# Altium schematic sheet Sensor.SchDoc
size A4; Organization: Altium Limited; Address1: L3, 12a Rodborough Rd; Address2: Frenchs Forest; Address3: NSW; Address4: Australia 2086
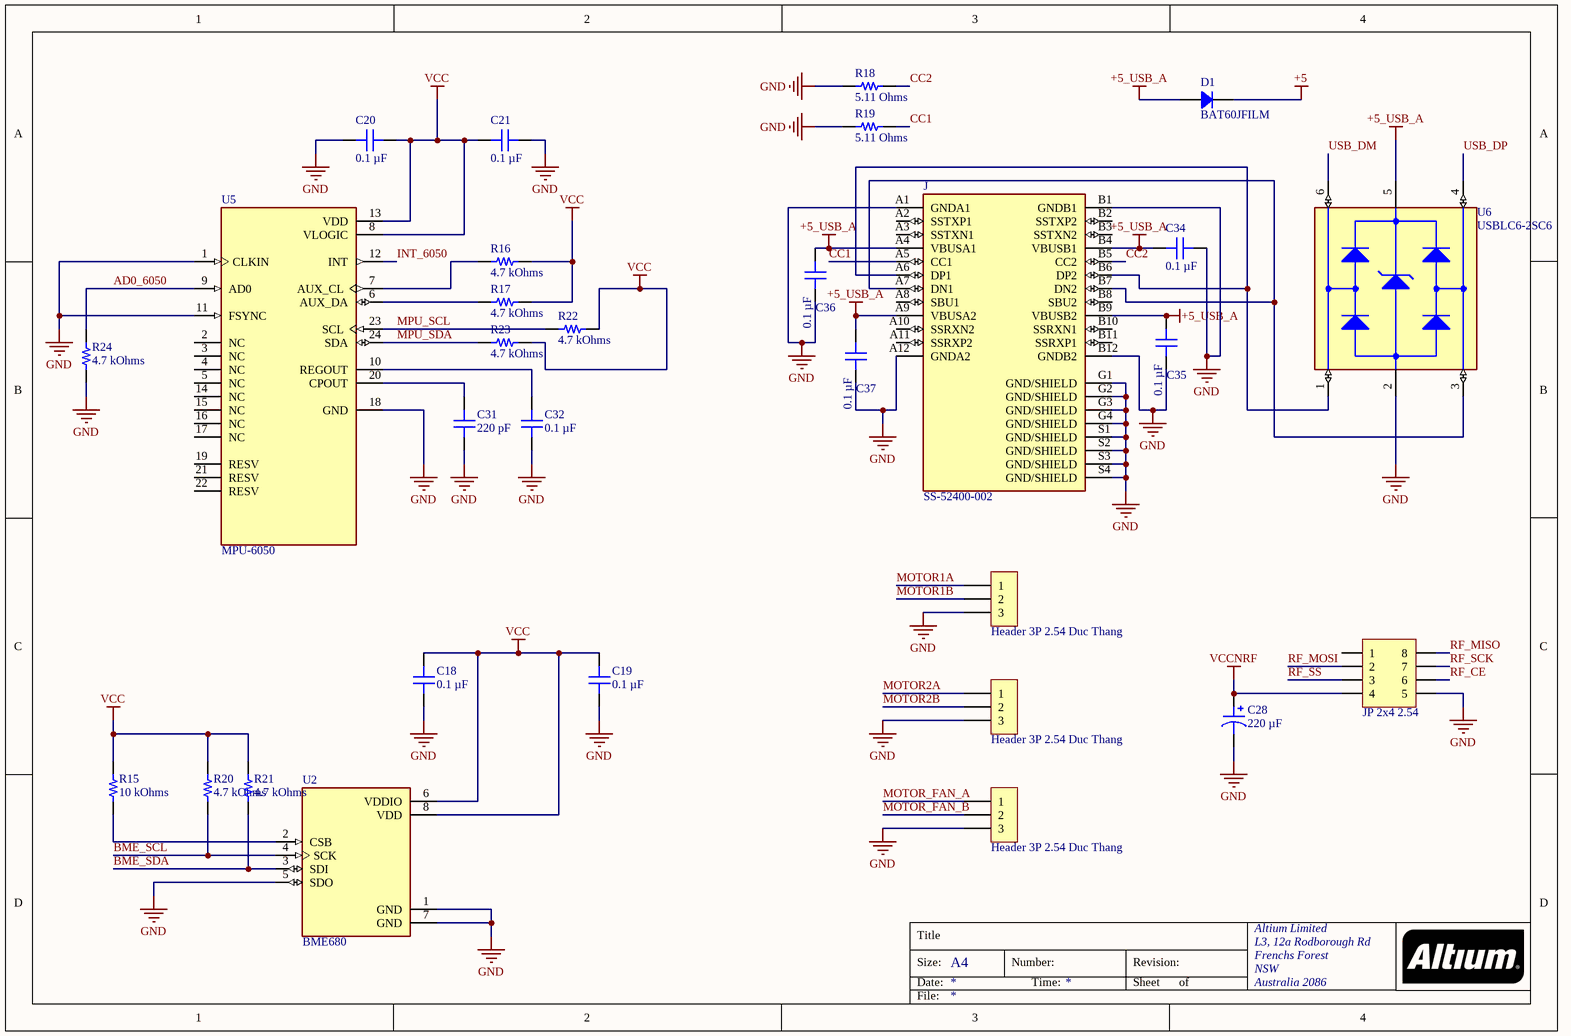
[diagram p0: Sensor.SchDoc]

## Parts
C18  0.1 µF  [CAP 0603_1608]
C19  0.1 µF  [CAP 0603_1608]
C20  0.1 µF  [CAP 0603_1608]
C21  0.1 µF  [CAP 0603_1608]
C28  220 µF  [CAP ALSMD 6.6MM H6.1MM]
C31  220 pF  [CAP 0603_1608]
C32  0.1 µF  [CAP 0603_1608]
C34  0.1 µF  [CAP 0402_1005]
C35  0.1 µF  [CAP 0402_1005]
C36  0.1 µF  [CAP 0402_1005]
C37  0.1 µF  [CAP 0402_1005]
D1  BAT60JFILM  [SOD323]
H3  Header 3P 2.54 Duc Thang  [XH2.54M-3]
H4  Header 3P 2.54 Duc Thang  [XH2.54M-3]
H7  Header 3P 2.54 Duc Thang  [XH2.54M-3]
J  SS-52400-002  [BELFUSE_SS-52400-002]
JP2  JP 2x4 2.54  [JP 2x4 CT]
R15  10 kOhms  [RES 0603_1608]
R16  4.7 kOhms  [RES 0603_1608]
R17  4.7 kOhms  [RES 0603_1608]
R18  5.11 Ohms  [RES 0603_1608]
R19  5.11 Ohms  [RES 0603_1608]
R20  4.7 kOhms  [RES 0603_1608]
R21  4.7 kOhms  [RES 0603_1608]
R22  4.7 kOhms  [RES 0603_1608]
R23  4.7 kOhms  [RES 0603_1608]
R24  4.7 kOhms  [RES 0603_1608]
U2  BME680  [PSON80P300X300X100-8N]
U5  MPU-6050  [QFN50P400X400X95-24N]
U6  USBLC6-2SC6  [SOT95P280X145-6N]

## Nets
+5: D1.2
+5_USB_A: C34.1 C35.1 C36.1 C37.1 D1.1 J.A4(VBUSA1) J.A9(VBUSA2) J.B4(VBUSB1) J.B9(VBUSB2) U6.5(VBUS)
GND: C18.1 C19.1 C20.1 C21.2 C28.2 C31.1 C32.1 C34.2 C35.2 C36.2 C37.2 H3.3 H4.3 H7.3 J.A1(GNDA1) J.A12(GNDA2) J.B1(GNDB1) J.B12(GNDB2) J.G1(GND/SHIELD) J.G2(GND/SHIELD) J.G3(GND/SHIELD) J.G4(GND/SHIELD) J.S1(GND/SHIELD) J.S2(GND/SHIELD) J.S3(GND/SHIELD) J.S4(GND/SHIELD) JP2.5 R18.1 R19.1 R24.1 U2.1(GND) U2.5(SDO) U2.7(GND) U5.1(CLKIN) U5.11(FSYNC) U5.18(GND) U6.2(GND)
VCC: C18.2 C19.2 C20.2 C21.1 R15.2 R16.2 R17.2 R20.2 R21.2 R22.2 R23.2 U2.6(VDDIO) U2.8(VDD) U5.8(VLOGIC) U5.13(VDD)
VCCNRF: C28.1 JP2.4
AD0_6050: R24.2 U5.9(AD0)
BME_SCL: R20.1 U2.4(SCK)
BME_SDA: R21.1 U2.3(SDI)
CC1: J.A5(CC1) R19.2
CC2: J.B5(CC2) R18.2
INT_6050: U5.12(INT)
MOTOR1A: H7.1
MOTOR1B: H7.2
MOTOR2A: H3.1
MOTOR2B: H3.2
MOTOR_FAN_A: H4.1
MOTOR_FAN_B: H4.2
MPU_SCL: R22.1 U5.23(SCL)
MPU_SDA: R23.1 U5.24(SDA)
RF_CE: JP2.6
RF_MISO: JP2.8
RF_MOSI: JP2.2
RF_SCK: JP2.7
RF_SS: JP2.3
USB_DM: U6.6(I/O1_OUT)
USB_DP: U6.4(I/O2_OUT)
NetC31_2: C31.2 U5.20(CPOUT)
NetC32_2: C32.2 U5.10(REGOUT)
NetJ_A6: J.A6(DP1) J.B6(DP2) U6.1(I/O1_IN)
NetJ_A7: J.A7(DN1) J.B7(DN2) U6.3(I/O2_IN)
NetR15_1: R15.1 U2.2(CSB)
NetR16_1: R16.1 U5.7(AUX_CL)
NetR17_1: R17.1 U5.6(AUX_DA)

Not connected (* = marked no-connect by the designer): J A2(SSTXP1) A3(SSTXN1) A8(SBU1) A10(SSRXN2) A11(SSRXP2) B2(SSTXP2) B3(SSTXN2) B8(SBU2) B10(SSRXN1) B11(SSRXP1); JP2 1; U5 2(NC) 3(NC) 4(NC) 5(NC) 14(NC) 15(NC) 16(NC) 17(NC) 19(RESV) 21(RESV) 22(RESV)

## Notes on the sheet
- Title
- Size:
- Date:
- A4
- Number:
- Time:
- Revision:
- Sheet
- of
- File:

## Library data of the parts
C18-C21 C32 = C0603C104J8RAC7867: CAP CER 0.1UF 10V X7R 0603; manufacturer: KEMET; Tolerance: ±5%; Part Number: C0603C104J8RAC7867; Value: 0.1 µF; Applications: Bypass, Decoupling; Capacitance: 0.1 µF; componentlink1description: Datasheet; componentlink1url: https://connect.kemet.com:7667/gateway/IntelliData-ComponentDocumentation/1.0/download/datasheet/C0603C104J8RACTU; componentlink2description: DigiKey Link; componentlink2url: https://www.digikey.com/en/products/detail/kemet/C0603C104J8RAC7867/2199774; Device Package: 0603 (1608 Metric); lastupdated: 2/9/2024 8:09:18 PM; Lifecycle Status: Active; Minimum Order: 1; Mounting Type: Surface Mount, MLCC; Operating Temperature: -55°C ~ 125°C; Package / Case: 0603 (1608 Metric); packaging: TapeAndReel; partid: 52171; Part Status: Active; price: 0.07; series: SMD Comm X7R; Size / Dimension: 0.063" L x 0.031" W (1.60mm x 0.80mm); Supplier 1: DigiKey; Supplier Part Number 1: 399-C0603C104J8RAC7867CT-ND; Temperature Coefficient: X7R; Thickness (Max): 0.034" (0.87mm); Voltage - Rated: 10V
C28 = UCM1A221MCL1GS: CAP ALUM 220UF 20% 10V SMD; manufacturer: Nichicon; Impedance: 260 mOhms; Lifetime @ Temp.: 2000 Hrs @ 105°C; Polarization: Polar; Ripple Current @ High Frequency: 300 mA @ 100 kHz; Ripple Current @ Low Frequency: 150 mA @ 120 Hz; Surface Mount Land Size: 0.260" L x 0.260" W (6.60mm x 6.60mm); Part Number: UCM1A221MCL1GS; Applications: Automotive; Capacitance: 220 µF; componentlink1description: Datasheet; componentlink1url: http://nichicon-us.com/english/products/pdfs/e-ucm.pdf; componentlink2description: DigiKey Link; componentlink2url: https://www.digikey.com/en/products/detail/nichicon/UCM1A221MCL1GS/4991832; Device Package: Radial, Can - SMD; Height - Seated (Max): 0.240" (6.10mm); lastupdated: 6/3/2024 8:16:09 PM; Lifecycle Status: Active; Minimum Order: 1; Mounting Type: Surface Mount; Operating Temperature: -55°C ~ 105°C; Package / Case: Radial, Can - SMD; packaging: TapeAndReel; partid: 27599; Part Status: Active; price: 0.13; Ratings: AEC-Q200; series: UCM; Size / Dimension: 0.248" Dia (6.30mm); Supplier 1: DigiKey; Supplier Part Number 1: 493-17470-1-ND; Tolerance: ±20%; value: 220 µF; Voltage - Rated: 10 V
C31 = KGM15AR71A221KT: CAP CER 220PF 10V X7R 0603; manufacturer: KYOCERA AVX; Tolerance: ±10%; Part Number: KGM15AR71A221KT; Value: 220 pF; Applications: General Purpose; Capacitance: 220 pF; componentlink1description: Datasheet; componentlink1url: https://datasheets.kyocera-avx.com/X7RDielectric.pdf; componentlink2description: DigiKey Link; componentlink2url: https://www.digikey.com/en/products/detail/kyocera-avx/KGM15AR71A221KT/1600720; Device Package: 0603 (1608 Metric); lastupdated: 2/9/2024 8:09:12 PM; Lifecycle Status: Active; Minimum Order: 1; Mounting Type: Surface Mount, MLCC; Operating Temperature: -55°C ~ 125°C; Package / Case: 0603 (1608 Metric); packaging: TapeAndReel; partid: 53248; Part Status: Active; price: 0.02; series: KGM - X7R; Size / Dimension: 0.063" L x 0.032" W (1.60mm x 0.81mm); Supplier 1: DigiKey; Supplier Part Number 1: 478-KGM15AR71A221KTCT-ND; Temperature Coefficient: X7R; Thickness (Max): 0.035" (0.90mm); Voltage - Rated: 10V
C34-C37 = KGM05AR71A104KH: CAP CER 0.1UF 10V X7R 0402; manufacturer: KYOCERA AVX; Tolerance: ±10%; Part Number: KGM05AR71A104KH; Value: 0.1 µF; Applications: General Purpose; Capacitance: 0.1 µF; componentlink1description: Datasheet; componentlink1url: https://datasheets.kyocera-avx.com/X7RDielectric.pdf; componentlink2description: DigiKey Link; componentlink2url: https://www.digikey.com/en/products/detail/kyocera-avx/KGM05AR71A104KH/3080133; Device Package: 0402 (1005 Metric); lastupdated: 2/9/2024 8:03:47 PM; Lifecycle Status: Active; Minimum Order: 1; Mounting Type: Surface Mount, MLCC; Operating Temperature: -55°C ~ 125°C; Package / Case: 0402 (1005 Metric); packaging: TapeAndReel; partid: 50766; Part Status: Active; price: 0.01; series: KGM - X7R; Size / Dimension: 0.039" L x 0.020" W (1.00mm x 0.50mm); Supplier 1: DigiKey; Supplier Part Number 1: 478-KGM05AR71A104KHCT-ND; Temperature Coefficient: X7R; Thickness (Max): 0.022" (0.55mm); Voltage - Rated: 10V
D1 = BAT60JFILM: DIODE SCHOTTKY 10V 3A SOD323; Manufacturer: STMicroelectronics; Current - Reverse Leakage @ Vr: 6 µA @ 10 V; Speed: Fast Recovery =< 500ns, > 200mA (Io); Voltage - Forward (Vf) (Max) @ If: 580 mV @ 1 A; Part Number: BAT60JFILM; ComponentLink1Description: Datasheet; ComponentLink1URL: http://www.st.com/content/ccc/resource/technical/document/datasheet/3d/d2/27/1d/20/e3/4d/48/CD00001944.pdf/files/CD00001944.pdf/jcr:content/translations/en.CD00001944.pdf; ComponentLink2Description: DigiKey Link; ComponentLink2URL: https://www.digikey.com/en/products/detail/stmicroelectronics/BAT60JFILM/686386; Current - Average Rectified (Io): 3A; Diode Type: Schottky; LastUpdated: 6/3/2024 8:20:13 PM; Lifecycle Status: Active; Minimum Order: 1; Mounting Type: Surface Mount; Operating Temperature - Junction: 150°C (Max); Package / Case: SC-76, SOD-323; Packaging: TapeAndReel; PartId: 3091; Part Status: Active; Price: 0.04; Series: -; Supplier 1: DigiKey; Supplier Part Number 1: 497-3707-1-ND; Supplier Device Package: SOD-323; Voltage - DC Reverse (Vr) (Max): 10 V
H3 H4 H7 = Header 3P 2.54 Duc Thang: Cắm; Ten_Linh_Kien: Header 3P XH2.54-3P Đực Thẳng; Don_Vi: Con; Ma_Hang: MH001292; Chung_Loai: Cắm
J = SS-52400-002: USB Type-C Connector | 1 Port | Right Angle Receptacle | Shielded | 0.039[1.00mm]; MF: Stewart Connector; Package: None; Mouser-Purchase-URL: https://snapeda.com/shop?store=Mouser&id=4629247; Value: *; Price: None; DigiKey-Purchase-URL: https://snapeda.com/shop?store=DigiKey&id=4629247; MP: SS-52400-002; Availability: Warning; SnapEDA_Link: https://www.snapeda.com/parts/SS-52400-002/Stewart%20Connector/view-part/4629247/?ref=snap
JP2 = JP 2x4 2.54 Cai Thang: Cắm; Ten_Linh_Kien: Jump Đôi Cái 2.54MM 2x20P Thẳng; Don_Vi: Con; Ma_Hang: MH008647; Ghi_Chu: *; Kieu_Chan: *; Chung_Loai: Cắm
R15 = CRCW060310K0FKEA: RES SMD 10K OHM 1% 1/10W 0603; Manufacturer: Vishay Dale; Power (Watts): 0.1W, 1/10W; Temperature Coefficient: ±100ppm/°C; Part Number: CRCW060310K0FKEA; Value: 10 kOhms; ComponentLink1Description: Datasheet; ComponentLink1URL: http://www.vishay.com/docs/20035/dcrcwe3.pdf; ComponentLink2Description: DigiKey Link; ComponentLink2URL: https://www.digikey.com/en/products/detail/vishay-dale/CRCW060310K0FKEA/1174782; Composition: Thick Film; Device Package: 0603 (1608 Metric); Features: Automotive AEC-Q200; Height - Seated (Max): 0.020" (0.50mm); LastUpdated: 2/9/2024 8:42:10 PM; Lifecycle Status: Active; Minimum Order: 1; Number of Terminations: 2; Operating Temperature: -55°C ~ 155°C; Package / Case: 0603 (1608 Metric); Packaging: CutTape; PartId: 24636; Part Status: Active; Price: 0.01; Ratings: AEC-Q200; Resistance: 10 kOhms; Series: CRCW; Size / Dimension: 0.061" L x 0.033" W (1.55mm x 0.85mm); Supplier 1: DigiKey; Supplier Part Number 1: 541-10.0KHCT-ND; Supplier Device Package: 0603; Tolerance: ±1%
R16 R17 R22-R24 = CR0603-FX-4701ELF: RES SMD 4.7K OHM 1% 1/10W 0603; Manufacturer: Bourns Inc.; Power (Watts): 0.1W, 1/10W; Temperature Coefficient: ±100ppm/°C; Part Number: CR0603-FX-4701ELF; Value: 4.7 kOhms; ComponentLink1Description: Datasheet; ComponentLink1URL: https://www.bourns.com/docs/Product-Datasheets/CHPREZTR.pdf; ComponentLink2Description: DigiKey Link; ComponentLink2URL: https://www.digikey.com/en/products/detail/bourns-inc/CR0603-FX-4701ELF/3740916; Composition: Thick Film; Device Package: 0603 (1608 Metric); Features: Moisture Resistant; Height - Seated (Max): 0.022" (0.55mm); LastUpdated: 2/9/2024 8:42:33 PM; Lifecycle Status: Active; Minimum Order: 1; Number of Terminations: 2; Operating Temperature: -55°C ~ 155°C; Package / Case: 0603 (1608 Metric); Packaging: CutTape; PartId: 21073; Part Status: Active; Price: 0.01; Resistance: 4.7 kOhms; Series: CR0603; Size / Dimension: 0.063" L x 0.031" W (1.60mm x 0.80mm); Supplier 1: DigiKey; Supplier Part Number 1: CR0603-FX-4701ELFCT-ND; Supplier Device Package: 0603; Tolerance: ±1%
R18 R19 = RMCF0603FT5R11: RES 5.11 OHM 1% 1/10W 0603; Manufacturer: Stackpole Electronics Inc; Power (Watts): 0.1W, 1/10W; Temperature Coefficient: ±200ppm/°C; Part Number: RMCF0603FT5R11; Value: 5.11 Ohms; ComponentLink1Description: Datasheet; ComponentLink1URL: https://www.seielect.com/catalog/sei-rmcf_rmcp.pdf; ComponentLink2Description: DigiKey Link; ComponentLink2URL: https://www.digikey.com/en/products/detail/stackpole-electronics-inc/RMCF0603FT5R11/1714085; Composition: Thick Film; Device Package: 0603 (1608 Metric); Features: Automotive AEC-Q200; Height - Seated (Max): 0.022" (0.55mm); LastUpdated: 2/9/2024 8:42:17 PM; Lifecycle Status: Active; Minimum Order: 1; Number of Terminations: 2; Operating Temperature: -55°C ~ 155°C; Package / Case: 0603 (1608 Metric); Packaging: CutTape; PartId: 23818; Part Status: Active; Price: 0.01; Ratings: AEC-Q200; Resistance: 5.11 Ohms; Series: RMCF; Size / Dimension: 0.061" L x 0.031" W (1.55mm x 0.80mm); Supplier 1: DigiKey; Supplier Part Number 1: 738-RMCF0603FT5R11CT-ND; Supplier Device Package: 0603; Tolerance: ±1%
R20 R21 = SG73S1JTTD4701F: RES 4.7K OHM 1% 1/5W 0603; Manufacturer: KOA Speer Electronics, Inc.; Power (Watts): 0.2W, 1/5W; Temperature Coefficient: ±100ppm/°C; Part Number: SG73S1JTTD4701F; Value: 4.7 kOhms; ComponentLink1Description: Datasheet; ComponentLink1URL: https://www.koaspeer.com/pdfs/SG73S.pdf; ComponentLink2Description: DigiKey Link; ComponentLink2URL: https://www.digikey.com/en/products/detail/koa-speer-electronics-inc/SG73S1JTTD4701F/10289615; Composition: Thick Film; Device Package: 0603 (1608 Metric); Features: Automotive AEC-Q200, Moisture Resistant, Pulse Withstanding; Height - Seated (Max): 0.022" (0.55mm); LastUpdated: 2/9/2024 8:40:42 PM; Lifecycle Status: Active; Minimum Order: 1; Number of Terminations: 2; Operating Temperature: -55°C ~ 155°C; Package / Case: 0603 (1608 Metric); Packaging: TapeAndReel; PartId: 77387; Part Status: Active; Price: 0.01; Ratings: AEC-Q200; Resistance: 4.7 kOhms; Series: SG73S; Size / Dimension: 0.063" L x 0.031" W (1.60mm x 0.80mm); Supplier 1: DigiKey; Supplier Part Number 1: 2019-SG73S1JTTD4701FCT-ND; Supplier Device Package: 0603; Tolerance: ±1%
U2 = BME680: Gas, Humidity, Pressure, Temperature Sensor IÂ²C, SPI Output; MF: Bosch Sensortec; Check_prices: https://www.snapeda.com/parts/BME680/Bosch+Sensortec/view-part/?ref=eda; Value: *; Availability: In Stock; MP: BME680; Price: None; Package: LGA-8 Bosch Tools; SnapEDA_Link: https://www.snapeda.com/parts/BME680/Bosch+Sensortec/view-part/?ref=snap; Purchase-URL: https://pricing.snapeda.com/search/part/BME680/?ref=eda
U5 = MPU-6050: MPU-6050 series Accelerometer, Gyroscope, 3 Axis Sensor Evaluation Board; MF: TDK InvenSense; SnapEDA_Link: https://www.snapeda.com/parts/MPU-6050/TDK+InvenSense/view-part/?ref=snap; Package: QFN-24 InvenSense; Value: *; MP: MPU-6050; Check_prices: https://www.snapeda.com/parts/MPU-6050/TDK+InvenSense/view-part/?ref=eda
U6 = USBLC6-2SC6: 17V Clamp 5A (8/20Âµs) Ipp Tvs Diode Surface Mount SOT-23-6; MF: STMicroelectronics; SnapEDA_Link: https://www.snapeda.com/parts/USBLC6-2SC6/STMicroelectronics/view-part/?ref=snap; Package: SOT-23-6 STMicroelectronics; Value: *; MP: USBLC6-2SC6; Check_prices: https://www.snapeda.com/parts/USBLC6-2SC6/STMicroelectronics/view-part/?ref=eda